# EAGLE design D1MPROTO (EAGLE 6.5.0)
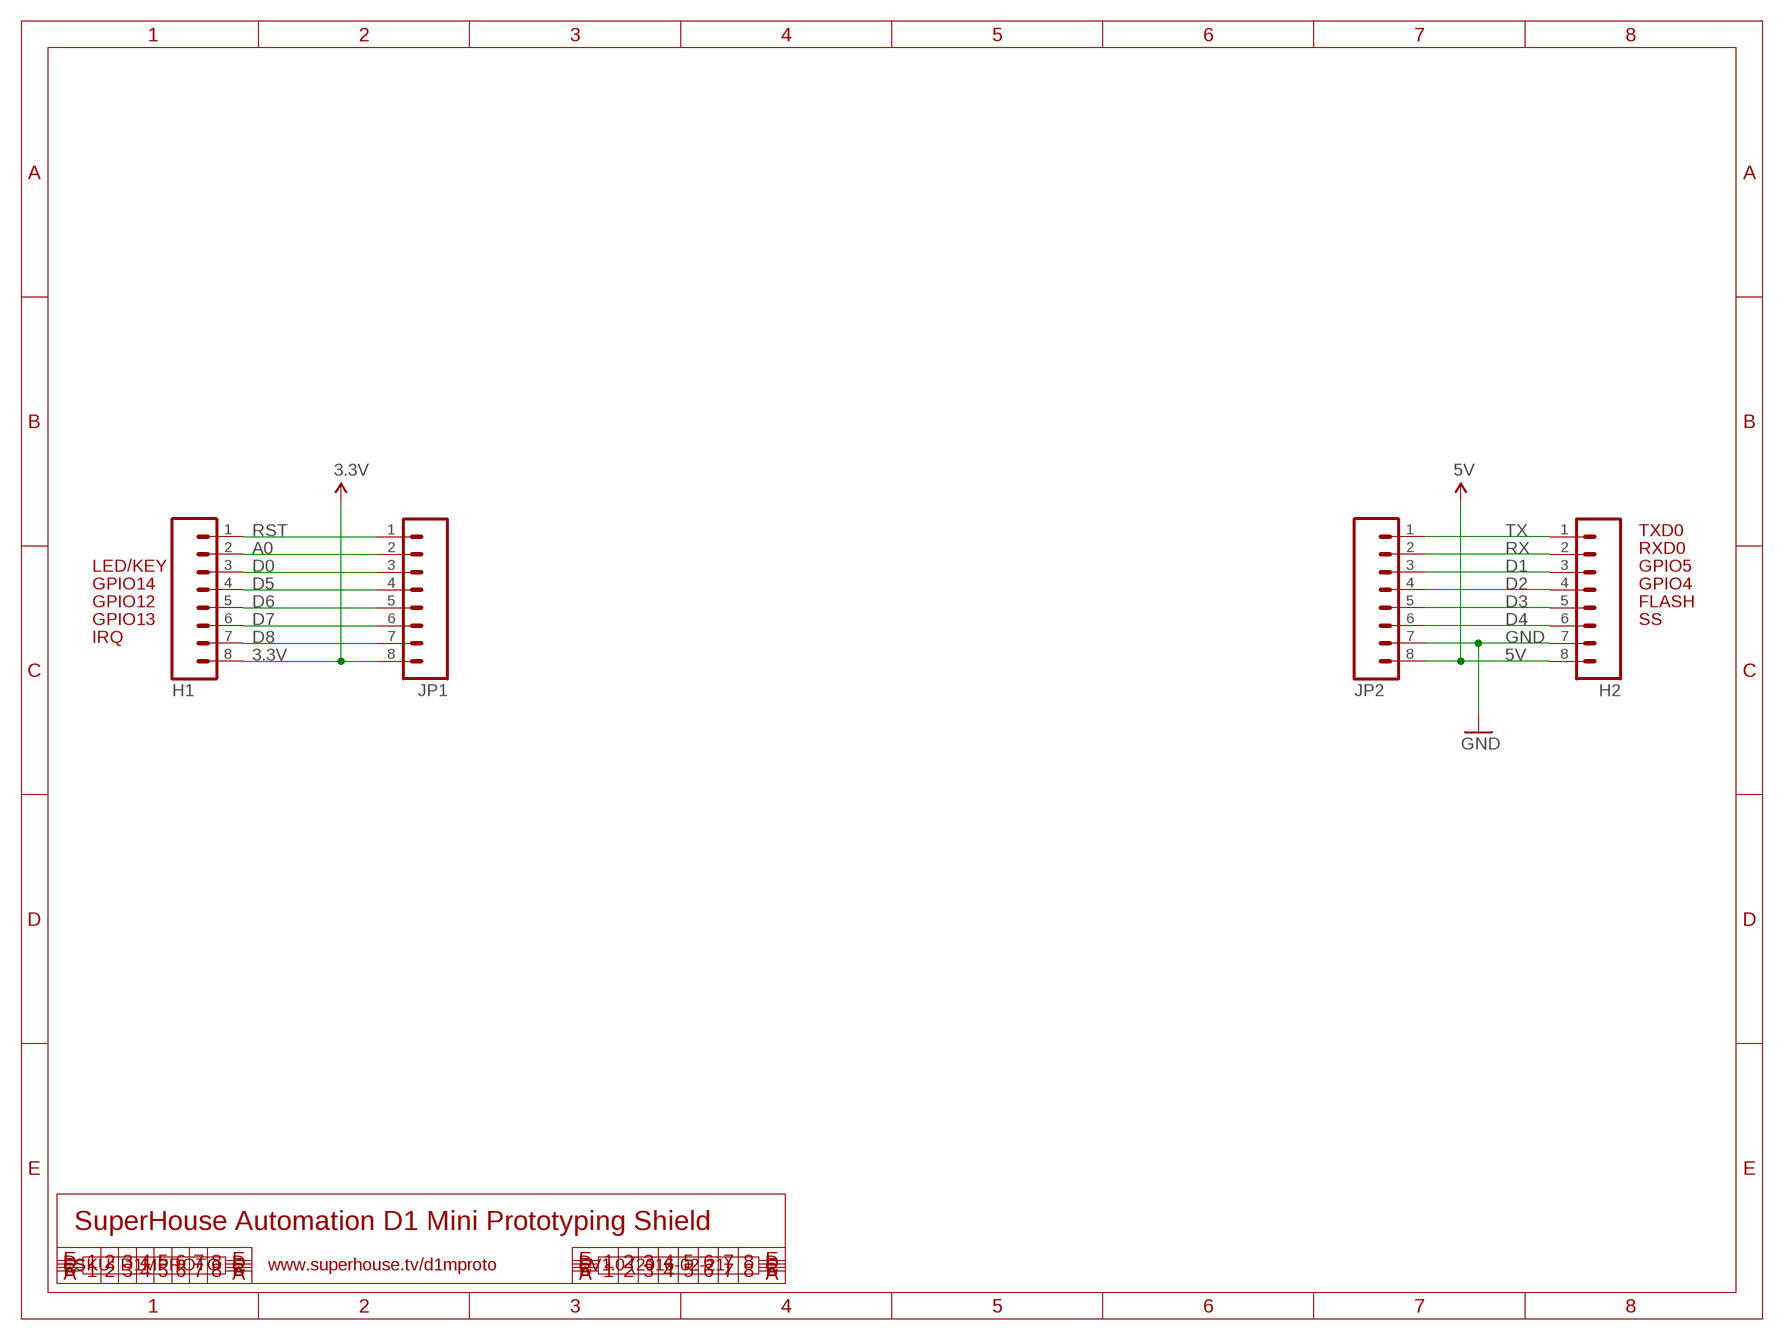
[diagram p0: schematic, sheet 1]

## Parts
H1  M08  [1X08]
H2  M08  [1X08]
JP1  M08  [1X08]
JP2  M08  [1X08]

## Nets
3.3V: H1.8 JP1.8
5V: H2.8 JP2.8
A0: H1.2 JP1.2
D0: H1.3 JP1.3
D1: H2.3 JP2.3
D2: H2.4 JP2.4
D3: H2.5 JP2.5
D4: H2.6 JP2.6
D5: H1.4 JP1.4
D6: H1.5 JP1.5
D7: H1.6 JP1.6
D8: H1.7 JP1.7
GND: H2.7 JP2.7
RST: H1.1 JP1.1
RX: H2.2 JP2.2
TX: H2.1 JP2.1

## Notes on the sheet
- TXD0
- RXD0
- LED/KEY | GPIO5
- GPIO14 | GPIO4
- GPIO12 | FLASH
- GPIO13 | SS
- IRQ
- SuperHouse Automation D1 Mini Prototyping Shield
- SKU: D1MPROTO | www.superhouse.tv/d1mproto | V1.0 (2016-02-21)

## Library data of the parts
H1 H2 JP1 JP2 = freetronics-original:M08: Header 8 Standard 8-pin 0.1" header. Use with straight break away headers (SKU : PRT-00116), right angle break away headers (PRT-00553), swiss pins (PRT-00743), machine pins (PRT-00117), and female headers (PRT-00115).

## Net classes
0 default: width 0.203 mm, drill 0.356 mm, clearance 0.152 mm
1 power: width 0.203 mm, clearance 0.152 mm

## Board
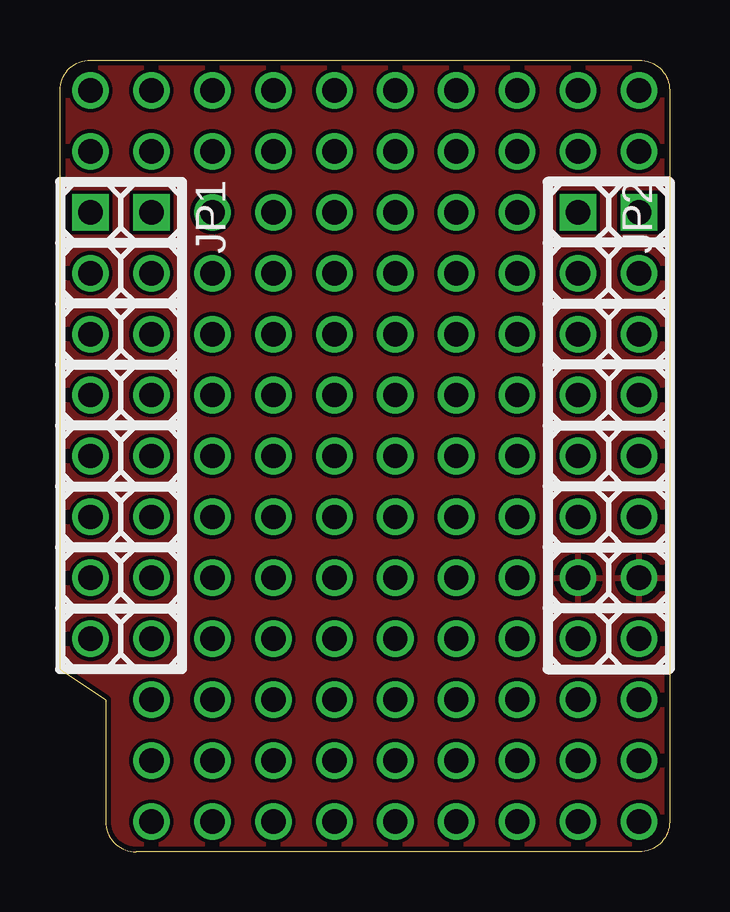
[diagram p1: board, top side]
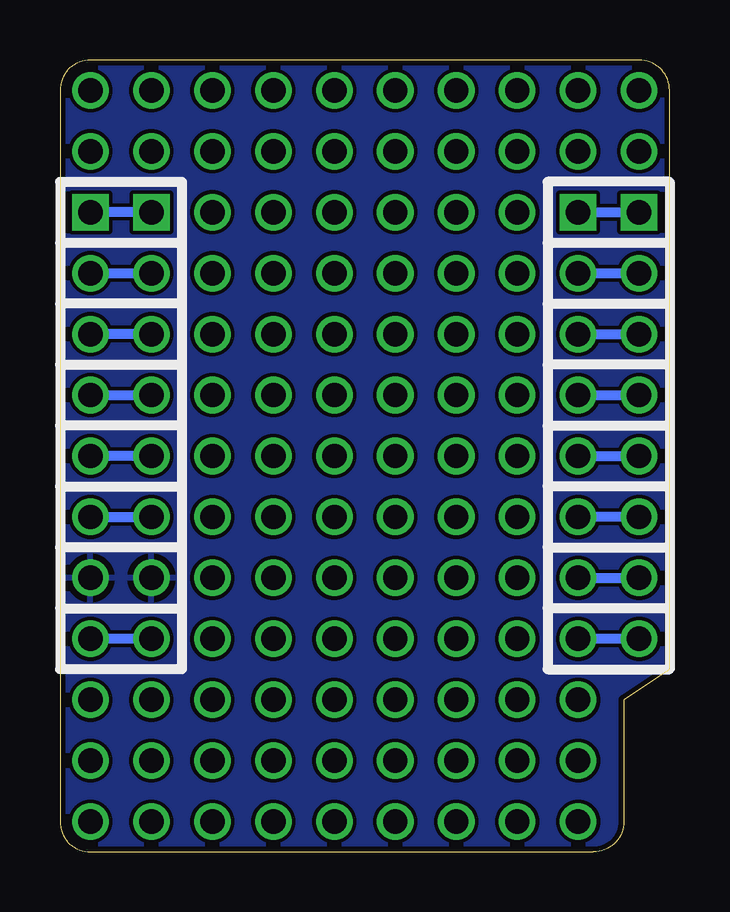
[diagram p2: board, bottom side, seen from below]

Size 25.4 x 33.02 mm. Coordinates in mm from the lower left corner, seen from the top.
Outline: 25.4,31.75 25.4,1.27 arc-90 24.13,0 3.17,0 arc-90 1.91,1.27 1.91,6.35 0,7.62 0,31.75 arc-90 1.27,33.02 24.13,33.02 arc-90 25.4,31.75
Copper layers (1*16): Top 0.035mm / dielectric 1.5mm / Bottom 0.035mm
Design rules "ElectroDragon_2layer_DRU_no_angle_20140221": minimum track width 6mil, minimum drill 12mil, track to track 6mil, track to pad 6mil, pad to pad 6mil, via to via 6mil, smd to smd 6mil, copper to edge 8mil, drill to drill 6mil, minimum pad ring 10mil, minimum via ring 6mil, stop-mask expansion 4mil, vias tented up to drill 100mil, thermal gap 10mil

### Footprints (pad centres in the part's own frame; a part is rotated, then mirrored left to right if it is on the bottom)
1X08 = drill 1.016 square: 1 0,0 | drill 1.016: 2 2.54,0; 3 5.08,0; 4 7.62,0; 5 10.16,0; 6 12.7,0; 7 15.24,0; 8 17.78,0

### Placement (x,y rotation side)
H1  1.27,26.67 270 top
H2  24.13,26.67 270 top
JP1  3.81,26.67 270 top
JP2  21.59,26.67 270 top

### Tracks (layer width: path | path; a pad name or v marks a point on that pad's centre or on a via)
3.3V
  Bottom 0.406: H1.8 JP1.8
5V
  Bottom 0.406: JP2.8 H2.8
A0
  Bottom 0.406: JP1.2 H1.2
D0
  Bottom 0.406: JP1.3 H1.3
D1
  Bottom 0.406: JP2.3 H2.3
D2
  Bottom 0.406: H2.4 JP2.4
D3
  Bottom 0.406: JP2.5 H2.5
D4
  Bottom 0.406: H2.6 JP2.6
D5
  Bottom 0.406: JP1.4 H1.4
D6
  Bottom 0.406: JP1.5 H1.5
D7
  Bottom 0.406: H1.6 JP1.6
D8
  Bottom 0.406: JP1.7 H1.7
GND
  pour Top: 25.4,31.75 arc90 24.13,33.02 1.27,33.02 arc90 0,31.75 0,7.62 1.91,6.35 1.91,1.27 arc90 3.17,0 24.13,0 arc90 25.4,1.27
  pour Bottom: 25.4,1.27 25.4,31.75 arc90 24.13,33.02 1.27,33.02 arc90 0,31.75 0,7.62 1.91,6.35 1.91,1.27 arc90 3.17,0 24.13,0 arc90
N$1  (via drill 1.02)
  other vias: 6.35,26.67
N$2  (via drill 1.02)
  other vias: 6.35,24.13
N$3  (via drill 1.02)
  other vias: 6.35,21.59
N$4  (via drill 1.02)
  other vias: 6.35,19.05
N$5  (via drill 1.02)
  other vias: 6.35,16.51
N$6  (via drill 1.02)
  other vias: 6.35,13.97
N$7  (via drill 1.02)
  other vias: 6.35,11.43
N$8  (via drill 1.02)
  other vias: 6.35,8.89
N$9  (via drill 1.02)
  other vias: 6.35,6.35
N$10  (via drill 1.02)
  other vias: 6.35,3.81
N$11  (via drill 1.02)
  other vias: 6.35,1.27
N$12  (via drill 1.02)
  other vias: 3.81,1.27
N$13  (via drill 1.02)
  other vias: 3.81,3.81
N$14  (via drill 1.02)
  other vias: 3.81,6.35
N$15  (via drill 1.02)
  other vias: 3.81,29.21
N$16  (via drill 1.02)
  other vias: 6.35,29.21
N$17  (via drill 1.02)
  other vias: 6.35,31.75
N$18  (via drill 1.02)
  other vias: 3.81,31.75
N$19  (via drill 1.02)
  other vias: 1.27,29.21
N$20  (via drill 1.02)
  other vias: 1.27,31.75
N$21  (via drill 1.02)
  other vias: 24.13,29.21
N$22  (via drill 1.02)
  other vias: 24.13,31.75
N$23  (via drill 1.02)
  other vias: 24.13,6.35
N$24  (via drill 1.02)
  other vias: 24.13,3.81
N$25  (via drill 1.02)
  other vias: 24.13,1.27
N$26  (via drill 1.02)
  other vias: 8.89,26.67
N$27  (via drill 1.02)
  other vias: 8.89,24.13
N$28  (via drill 1.02)
  other vias: 8.89,21.59
N$29  (via drill 1.02)
  other vias: 8.89,19.05
N$30  (via drill 1.02)
  other vias: 8.89,16.51
N$31  (via drill 1.02)
  other vias: 8.89,13.97
N$32  (via drill 1.02)
  other vias: 8.89,11.43
N$33  (via drill 1.02)
  other vias: 8.89,8.89
N$34  (via drill 1.02)
  other vias: 8.89,6.35
N$35  (via drill 1.02)
  other vias: 8.89,3.81
N$36  (via drill 1.02)
  other vias: 8.89,1.27
N$37  (via drill 1.02)
  other vias: 8.89,29.21
N$38  (via drill 1.02)
  other vias: 8.89,31.75
N$39  (via drill 1.02)
  other vias: 11.43,26.67
N$40  (via drill 1.02)
  other vias: 11.43,24.13
N$41  (via drill 1.02)
  other vias: 11.43,21.59
N$42  (via drill 1.02)
  other vias: 11.43,19.05
N$43  (via drill 1.02)
  other vias: 11.43,16.51
N$44  (via drill 1.02)
  other vias: 11.43,13.97
N$45  (via drill 1.02)
  other vias: 11.43,11.43
N$46  (via drill 1.02)
  other vias: 11.43,8.89
N$47  (via drill 1.02)
  other vias: 11.43,6.35
N$48  (via drill 1.02)
  other vias: 11.43,3.81
N$49  (via drill 1.02)
  other vias: 11.43,1.27
N$50  (via drill 1.02)
  other vias: 11.43,29.21
N$51  (via drill 1.02)
  other vias: 11.43,31.75
N$52  (via drill 1.02)
  other vias: 13.97,26.67
N$53  (via drill 1.02)
  other vias: 13.97,24.13
N$54  (via drill 1.02)
  other vias: 13.97,21.59
N$55  (via drill 1.02)
  other vias: 13.97,19.05
N$56  (via drill 1.02)
  other vias: 13.97,16.51
N$57  (via drill 1.02)
  other vias: 13.97,13.97
N$58  (via drill 1.02)
  other vias: 13.97,11.43
N$59  (via drill 1.02)
  other vias: 13.97,8.89
N$60  (via drill 1.02)
  other vias: 13.97,6.35
N$61  (via drill 1.02)
  other vias: 13.97,3.81
N$62  (via drill 1.02)
  other vias: 13.97,1.27
N$63  (via drill 1.02)
  other vias: 13.97,29.21
N$64  (via drill 1.02)
  other vias: 13.97,31.75
N$65  (via drill 1.02)
  other vias: 16.51,26.67
N$66  (via drill 1.02)
  other vias: 16.51,24.13
N$67  (via drill 1.02)
  other vias: 16.51,21.59
N$68  (via drill 1.02)
  other vias: 16.51,19.05
N$69  (via drill 1.02)
  other vias: 16.51,16.51
N$70  (via drill 1.02)
  other vias: 16.51,13.97
N$71  (via drill 1.02)
  other vias: 16.51,11.43
N$72  (via drill 1.02)
  other vias: 16.51,8.89
N$73  (via drill 1.02)
  other vias: 16.51,6.35
N$74  (via drill 1.02)
  other vias: 16.51,3.81
N$75  (via drill 1.02)
  other vias: 16.51,1.27
N$76  (via drill 1.02)
  other vias: 16.51,29.21
N$77  (via drill 1.02)
  other vias: 16.51,31.75
N$78  (via drill 1.02)
  other vias: 19.05,26.67
N$79  (via drill 1.02)
  other vias: 19.05,24.13
N$80  (via drill 1.02)
  other vias: 19.05,21.59
N$81  (via drill 1.02)
  other vias: 19.05,19.05
N$82  (via drill 1.02)
  other vias: 19.05,16.51
N$83  (via drill 1.02)
  other vias: 19.05,13.97
N$84  (via drill 1.02)
  other vias: 19.05,11.43
N$85  (via drill 1.02)
  other vias: 19.05,8.89
N$86  (via drill 1.02)
  other vias: 19.05,6.35
N$87  (via drill 1.02)
  other vias: 19.05,3.81
N$88  (via drill 1.02)
  other vias: 19.05,1.27
N$89  (via drill 1.02)
  other vias: 19.05,29.21
N$90  (via drill 1.02)
  other vias: 19.05,31.75
N$91  (via drill 1.02)
  other vias: 21.59,29.21
N$92  (via drill 1.02)
  other vias: 21.59,31.75
N$93  (via drill 1.02)
  other vias: 21.59,6.35
N$94  (via drill 1.02)
  other vias: 21.59,3.81
N$95  (via drill 1.02)
  other vias: 21.59,1.27
RST
  Bottom 0.406: JP1.1 H1.1
RX
  Bottom 0.406: H2.2 JP2.2
TX
  Bottom 0.406: JP2.1 H2.1